# Altium schematic sheet [05] - ADC.SchDoc
size A3
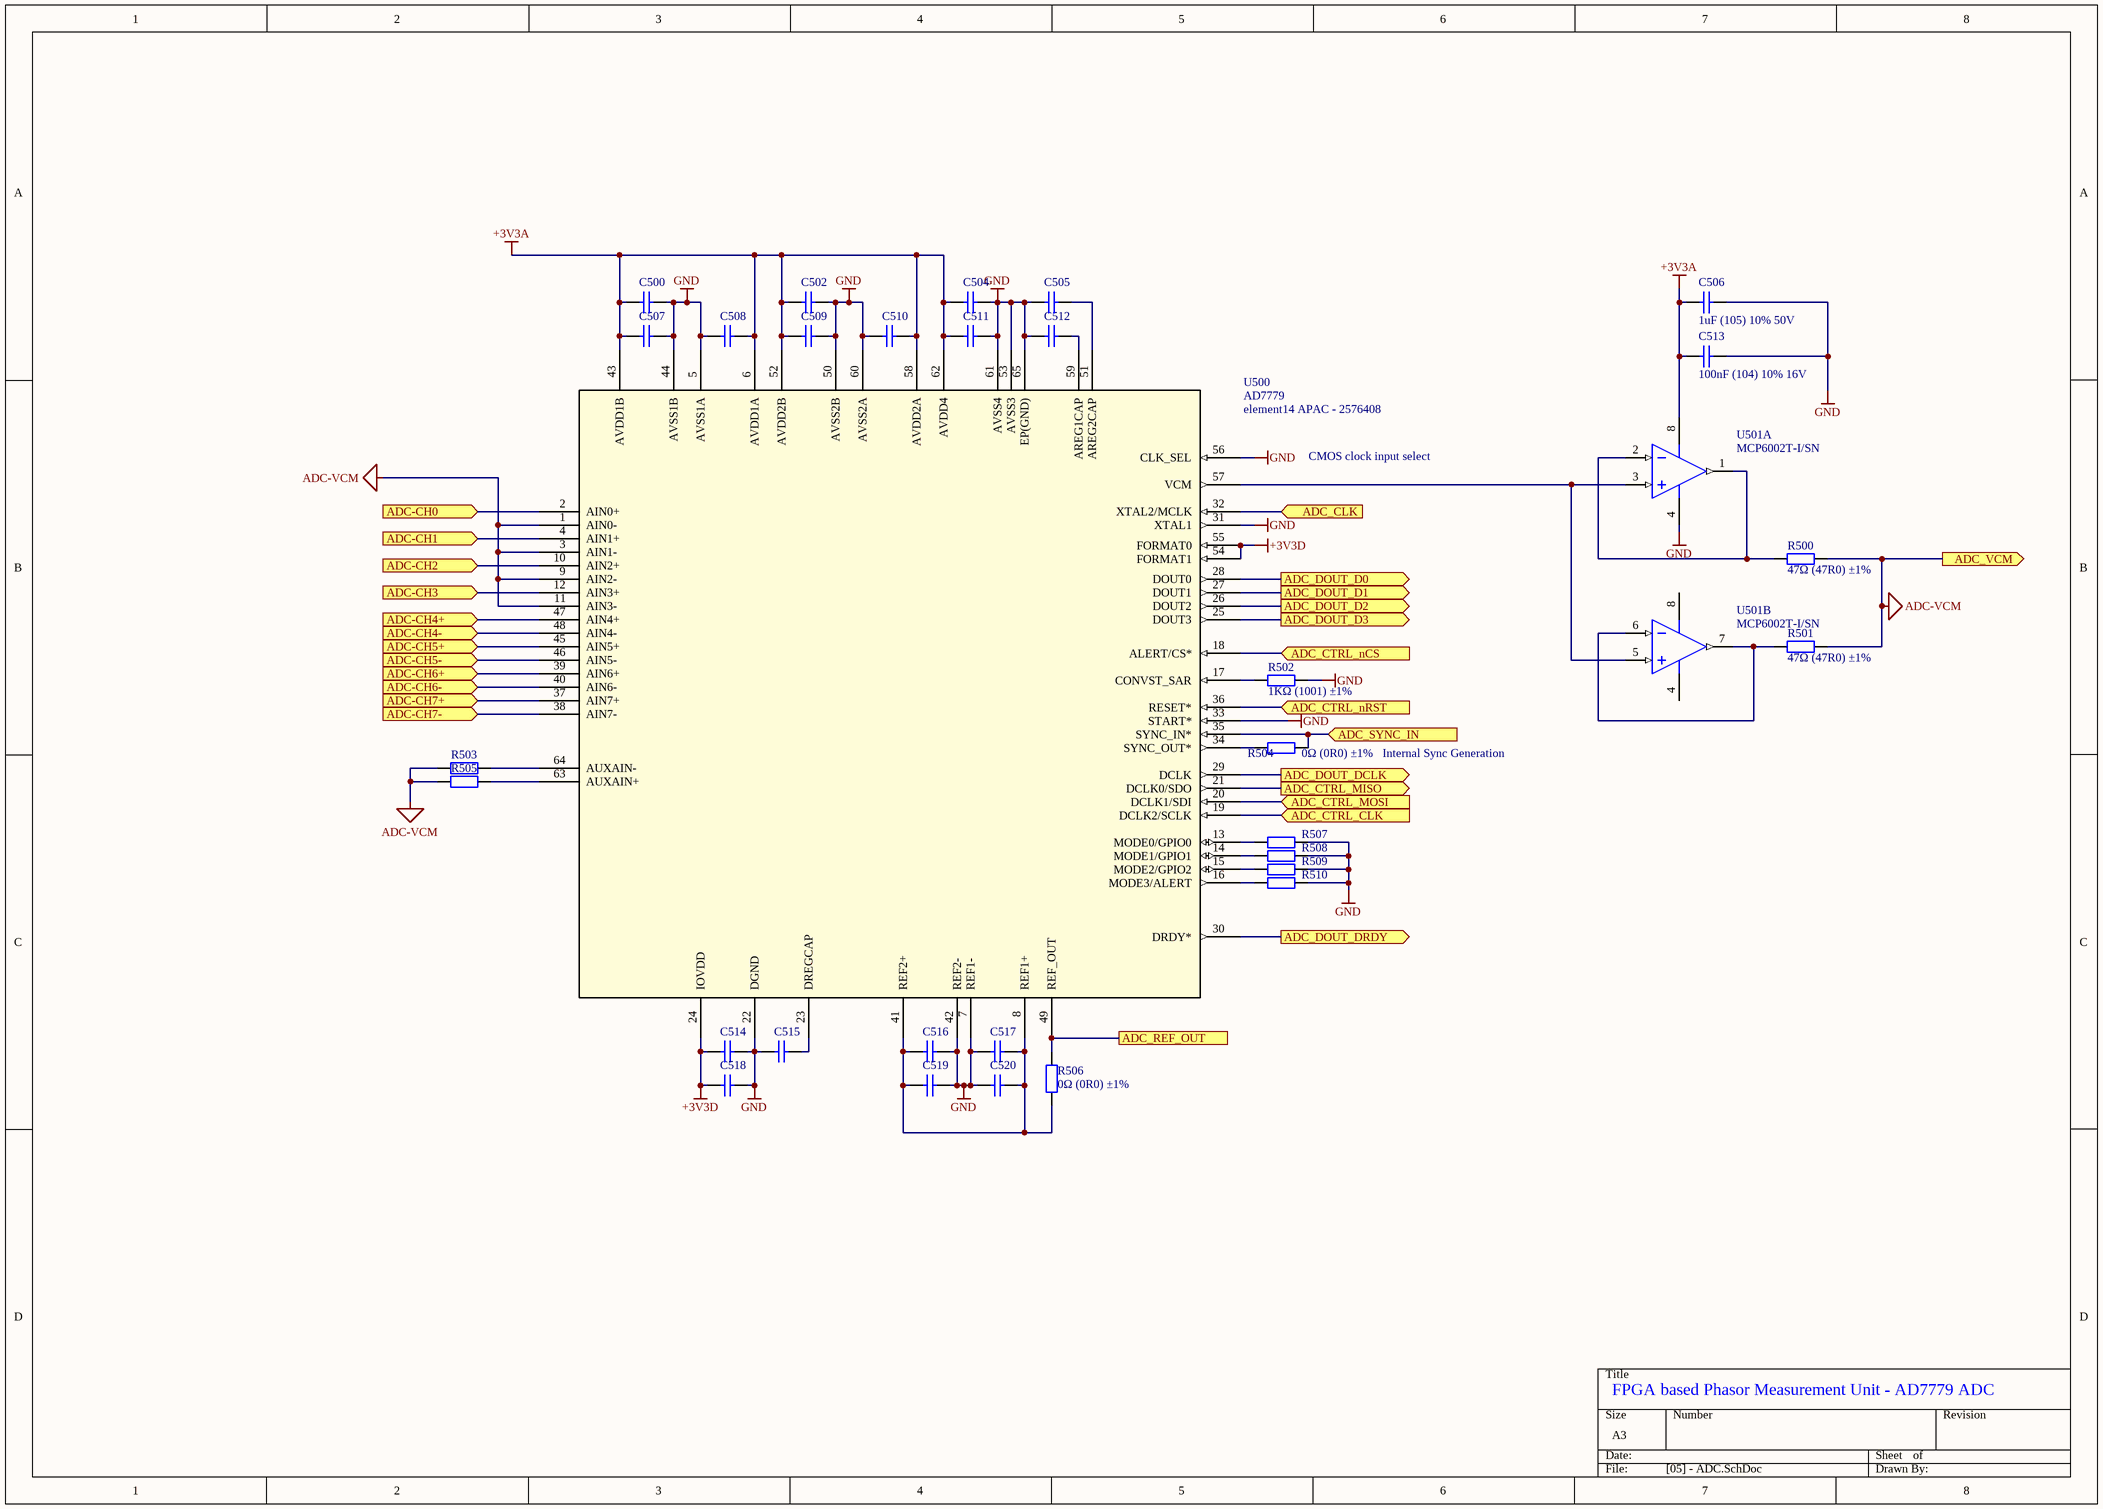
[diagram p0: [05] - ADC.SchDoc]

## Parts
C500  1uF (105) 10% 50V  [0603_C]  (value not drawn)
C502  1uF (105) 10% 50V  [0603_C]  (value not drawn)
C504  1uF (105) 10% 50V  [0603_C]  (value not drawn)
C505  100nF (104) 10% 16V  [0402_C]  (value not drawn)
C506  1uF (105) 10% 50V  [0603_C]
C507  100nF (104) 10% 16V  [0402_C]  (value not drawn)
C508  100nF (104) 10% 16V  [0402_C]  (value not drawn)
C509  100nF (104) 10% 16V  [0402_C]  (value not drawn)
C510  100nF (104) 10% 16V  [0402_C]  (value not drawn)
C511  100nF (104) 10% 16V  [0402_C]  (value not drawn)
C512  100nF (104) 10% 16V  [0402_C]  (value not drawn)
C513  100nF (104) 10% 16V  [0402_C]
C514  100nF (104) 10% 16V  [0402_C]  (value not drawn)
C515  100nF (104) 10% 16V  [0402_C]  (value not drawn)
C516  100nF (104) 10% 16V  [0402_C]  (value not drawn)
C517  100nF (104) 10% 16V  [0402_C]  (value not drawn)
C518  1uF (105) 10% 50V  [0603_C]  (value not drawn)
C519  1uF (105) 10% 50V  [0603_C]  (value not drawn)
C520  1uF (105) 10% 50V  [0603_C]  (value not drawn)
R500  47Ω (47R0) ±1%  [0603_R]
R501  47Ω (47R0) ±1%  [0603_R]
R502  1KΩ (1001) ±1%  [0402_R]
R503  1KΩ (1001) ±1%  [0402_R]  (value not drawn)
R504  0Ω (0R0) ±1%  [0402_R]
R505  1KΩ (1001) ±1%  [0402_R]  (value not drawn)
R506  0Ω (0R0) ±1%  [0402_R]
R507  1KΩ (1001) ±1%  [0402_R]  (value not drawn)
R508  1KΩ (1001) ±1%  [0402_R]  (value not drawn)
R509  1KΩ (1001) ±1%  [0402_R]  (value not drawn)
R510  1KΩ (1001) ±1%  [0402_R]  (value not drawn)
U500  AD7779  Supplier Part Number 1: element14 APAC - 2576408  [CP_64_15]
U501  MCP6002T-I/SN  [SOIC-8_150mil]  (parts A,B of 2)

## Ports
ADC-CH0 (in), ADC-CH1 (in), ADC-CH2 (in), ADC-CH3 (in), ADC-CH4+ (in), ADC-CH4- (in), ADC-CH5+ (in), ADC-CH5- (in), ADC-CH6+ (in), ADC-CH6- (in), ADC-CH7+ (in), ADC-CH7- (in), ADC_CLK (in), ADC_CTRL_CLK (in), ADC_CTRL_MISO (out), ADC_CTRL_MOSI (in), ADC_CTRL_nCS (in), ADC_CTRL_nRST (in), ADC_DOUT_D0 (out), ADC_DOUT_D1 (out), ADC_DOUT_D2 (out), ADC_DOUT_D3 (out), ADC_DOUT_DCLK (out), ADC_DOUT_DRDY (out), ADC_REF_OUT, ADC_SYNC_IN (in), ADC_VCM (out)

## Nets
+3V3A: C500.1 C502.1 C504.1 C506.1 C507.1 C508.2 C509.1 C510.2 C511.1 C513.1 U500.6(AVDD1A) U500.43(AVDD1B) U500.52(AVDD2B) U500.58(AVDD2A) U500.62(AVDD4) U501.8(VDD)
+3V3D: C514.1 C518.1 U500.24(IOVDD) U500.54(FORMAT1) U500.55(FORMAT0)
ADC-VCM: R500.2 R501.2 R503.1 R505.1 U500.1(AIN0-) U500.3(AIN1-) U500.9(AIN2-) U500.11(AIN3-) ; port ADC_VCM
GND: C500.2 C502.2 C504.2 C505.1 C506.2 C507.2 C508.1 C509.2 C510.1 C511.2 C512.1 C513.2 C514.2 C515.1 C516.2 C517.1 C518.2 C519.2 C520.1 R502.2 R507.2 R508.2 R509.2 R510.2 U500.5(AVSS1A) U500.7(REF1-) U500.22(DGND) U500.31(XTAL1) U500.33(START*) U500.42(REF2-) U500.44(AVSS1B) U500.50(AVSS2B) U500.53(AVSS3) U500.56(CLK_SEL) U500.60(AVSS2A) U500.61(AVSS4) U500.65(EP(GND)) U501.4(VSS)
ADC-CH0: U500.2(AIN0+) ; port ADC-CH0
ADC-CH1: U500.4(AIN1+) ; port ADC-CH1
ADC-CH2: U500.10(AIN2+) ; port ADC-CH2
ADC-CH3: U500.12(AIN3+) ; port ADC-CH3
ADC-CH4+: U500.47(AIN4+) ; port ADC-CH4+
ADC-CH4-: U500.48(AIN4-) ; port ADC-CH4-
ADC-CH5+: U500.45(AIN5+) ; port ADC-CH5+
ADC-CH5-: U500.46(AIN5-) ; port ADC-CH5-
ADC-CH6+: U500.39(AIN6+) ; port ADC-CH6+
ADC-CH6-: U500.40(AIN6-) ; port ADC-CH6-
ADC-CH7+: U500.37(AIN7+) ; port ADC-CH7+
ADC-CH7-: U500.38(AIN7-) ; port ADC-CH7-
ADC_CLK: U500.32(XTAL2/MCLK) ; port ADC_CLK
ADC_CTRL_CLK: U500.19(DCLK2/SCLK) ; port ADC_CTRL_CLK
ADC_CTRL_MISO: U500.21(DCLK0/SDO) ; port ADC_CTRL_MISO
ADC_CTRL_MOSI: U500.20(DCLK1/SDI) ; port ADC_CTRL_MOSI
ADC_CTRL_nCS: U500.18(ALERT/CS*) ; port ADC_CTRL_nCS
ADC_CTRL_nRST: U500.36(RESET*) ; port ADC_CTRL_nRST
ADC_DOUT_D0: U500.28(DOUT0) ; port ADC_DOUT_D0
ADC_DOUT_D1: U500.27(DOUT1) ; port ADC_DOUT_D1
ADC_DOUT_D2: U500.26(DOUT2) ; port ADC_DOUT_D2
ADC_DOUT_D3: U500.25(DOUT3) ; port ADC_DOUT_D3
ADC_DOUT_DCLK: U500.29(DCLK) ; port ADC_DOUT_DCLK
ADC_DOUT_DRDY: U500.30(DRDY*) ; port ADC_DOUT_DRDY
ADC_REF_OUT: R506.2 U500.49(REF_OUT) ; port ADC_REF_OUT
ADC_SYNC_IN: R504.2 U500.35(SYNC_IN*) ; port ADC_SYNC_IN
NetC505_2: C505.2 U500.51(AREG2CAP)
NetC512_2: C512.2 U500.59(AREG1CAP)
NetC515_2: C515.2 U500.23(DREGCAP)
NetC516_1: C516.1 C517.2 C519.1 C520.2 R506.1 U500.8(REF1+) U500.41(REF2+)
NetR500_1: R500.1 U501.1(VOUTA) U501.2(VINA-)
NetR501_1: R501.1 U501.6(VINB-) U501.7(VOUTB)
NetR502_1: R502.1 U500.17(CONVST_SAR)
NetR503_2: R503.2 U500.64(AUXAIN-)
NetR504_1: R504.1 U500.34(SYNC_OUT*)
NetR505_2: R505.2 U500.63(AUXAIN+)
NetR507_1: R507.1 U500.13(MODE0/GPIO0)
NetR508_1: R508.1 U500.14(MODE1/GPIO1)
NetR509_1: R509.1 U500.15(MODE2/GPIO2)
NetR510_1: R510.1 U500.16(MODE3/ALERT)
NetU500_57: U500.57(VCM) U501.3(VINA+) U501.5(VINB+)

## Notes on the sheet
- CMOS clock input select
- Internal Sync Generation
- FPGA based Phasor Measurement Unit - AD7779 ADC

## Library data of the parts
C500 C502 C504 C506 C518-C520 = 0603 1uF (105) 10% 50V: 贴片电容; ComponentLink1Description: 供应商链接; ComponentLink1URL: http://www.szlcsc.com/product/details_16531.html; Package: 0603; Supplier: LC; SuppliersPartNumber: C15849
C505 C507-C517 = 0402 100nF (104) 10% 16V: 贴片电容; ComponentLink1Description: 供应商链接; ComponentLink1URL: http://www.szlcsc.com/product/details_1877.html; Package: 0402; Supplier: LC; SuppliersPartNumber: C1525
R500 R501 = 0603 47Ω (47R0) 1%: 贴片电阻; ComponentLink1Description: 供应商链接; ComponentLink1URL: http://www.szlcsc.com/product/details_23909.html; Package: 0603; Supplier: LC; SuppliersPartNumber: C23182
R502 R503 R505 R507-R510 = 0402 1KΩ (1001) 1%: 贴片电阻; ComponentLink1Description: 供应商链接; ComponentLink1URL: http://www.szlcsc.com/product/details_12256.html; Package: 0402; Supplier: LC; SuppliersPartNumber: C11702
R504 R506 = 0402 0Ω (0R0) 1%: 贴片电阻; ComponentLink1Description: 供应商链接; ComponentLink1URL: http://www.szlcsc.com/product/details_17853.html; Package: 0402; Supplier: LC; SuppliersPartNumber: C17168
U500 = AD7779ACPZ: ADC - 8 Channel; Supplier 1: Octopart; JLCPCB: NO
U501 = MCP6002T-I/SN_[C7377]: 运放; ComponentLink1Description: 供应商链接; ComponentLink1URL: http://www.szlcsc.com/product/details_7854.html; Package: SOIC-8_150mil; Supplier: LC; SuppliersPartNumber: C7377